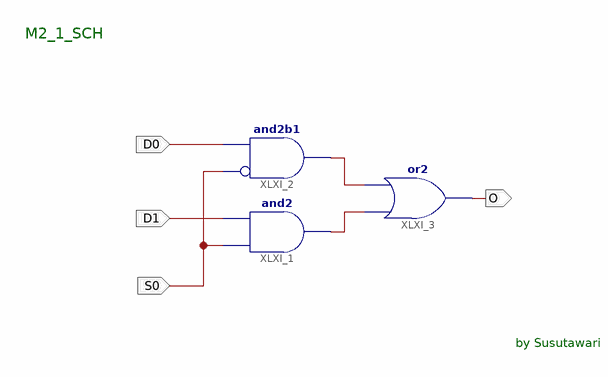
[diagram p0: schematic sheet 1]
// Xilinx ISE schematic M2_1_SCH.sch (spartan3a) as structural Verilog: 3 symbols, 4 ports
module M2_1_SCH (
  input  D1,
  input  D0,
  input  S0,
  output O
);

  wire XLXN_1, XLXN_2;

  or XLXI_3 (O, XLXN_2, XLXN_1);
  and XLXI_2 (XLXN_1, ~S0, D0);  // and2b1
  and XLXI_1 (XLXN_2, S0, D1);

  // Notes on the sheet:
  //   M2_1_SCH
  //   by Susutawari
endmodule
